# Altium schematic sheet LineDetector.SchDoc
size A; SheetNumber: 1; SheetTotal: 1
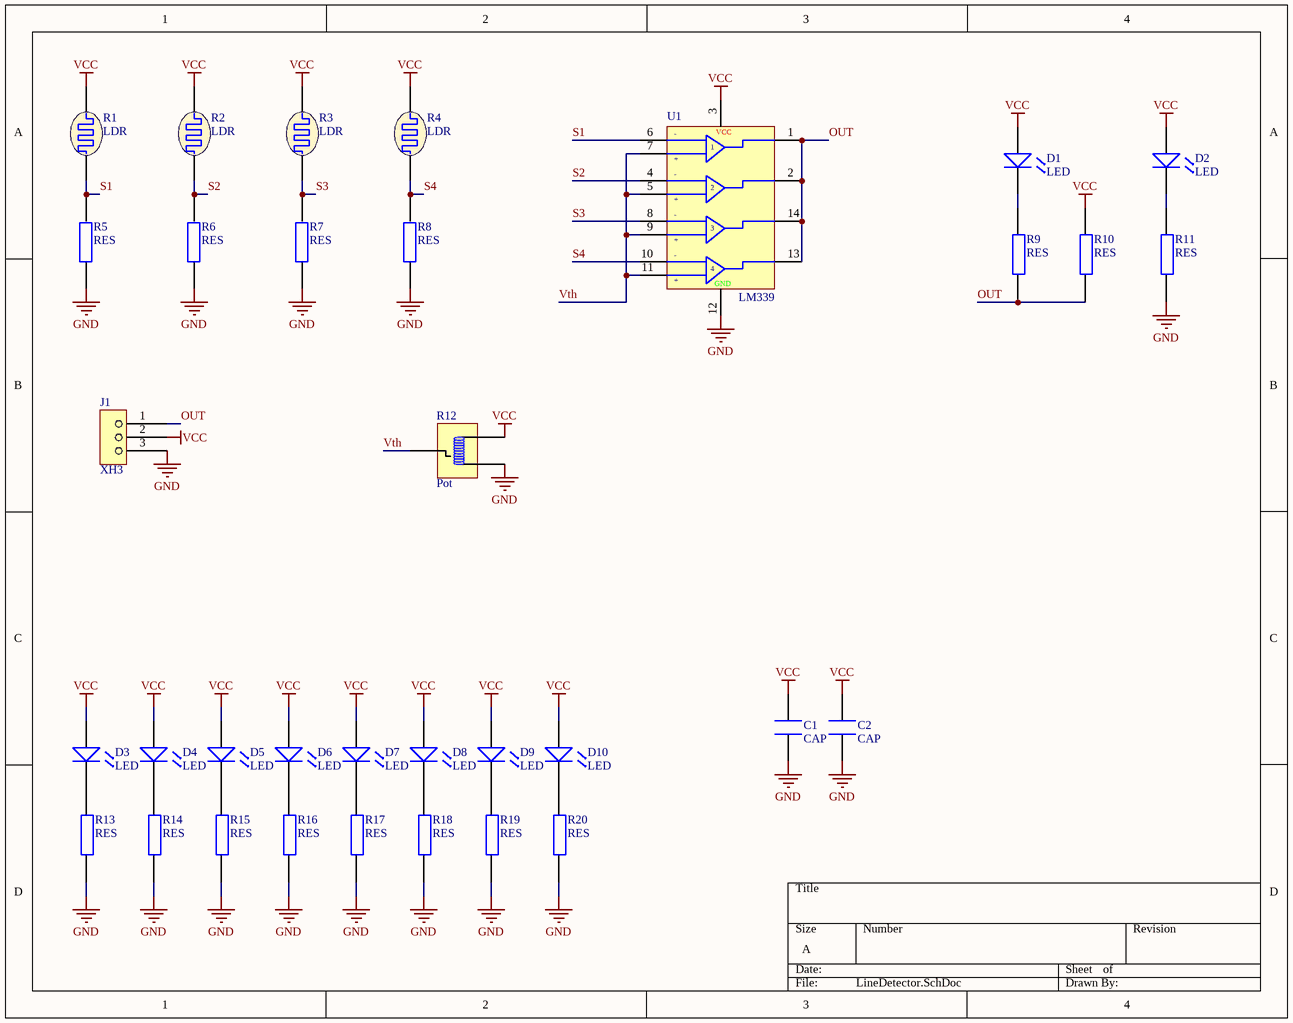
[diagram p0: LineDetector.SchDoc]

## Parts
C1  CAP  [CAP1206]
C2  CAP  [CAP1206]
D1  LED  [LED GREEN 1206]
D2  LED  [LED GREEN 1206]
D3  LED  [LED BLUE 1206]
D4  LED  [LED BLUE 1206]
D5  LED  [LED BLUE 1206]
D6  LED  [LED BLUE 1206]
D7  LED  [LED BLUE 1206]
D8  LED  [LED BLUE 1206]
D9  LED  [LED BLUE 1206]
D10  LED  [LED BLUE 1206]
J1  XH3  [XH 3PIN]
R1  LDR  [LDR]
R2  LDR  [LDR]
R3  LDR  [LDR]
R4  LDR  [LDR]
R5  RES  [RES1206]
R6  RES  [RES1206]
R7  RES  [RES1206]
R8  RES  [RES1206]
R9  RES  [RES1206]
R10  RES  [RES1206]
R11  RES  [RES1206]
R12  Pot  [potentiometer]
R13  RES  [RES1206]
R14  RES  [RES1206]
R15  RES  [RES1206]
R16  RES  [RES1206]
R17  RES  [RES1206]
R18  RES  [RES1206]
R19  RES  [RES1206]
R20  RES  [RES1206]
U1  LM339  [LM339]

## Nets
GND: C1.1 C2.1 J1.3 R5.1 R6.1 R7.1 R8.1 R11.2 R12.1 R13.2 R14.2 R15.2 R16.2 R17.2 R18.2 R19.2 R20.2 U1.12
VCC: C1.2 C2.2 D1.1 D2.1 D3.1 D4.1 D5.1 D6.1 D7.1 D8.1 D9.1 D10.1 J1.2 R1.1 R2.1 R3.1 R4.1 R10.1 R12.3 U1.3
OUT: J1.1 R9.2 R10.2 U1.1 U1.2 U1.13 U1.14
S1: R1.2 R5.2 U1.6
S2: R2.2 R6.2 U1.4
S3: R3.2 R7.2 U1.8
S4: R4.2 R8.2 U1.10
Vth: R12.2 U1.5 U1.7 U1.9 U1.11
NetD1_2: D1.2 R9.1
NetD2_2: D2.2 R11.1
NetD3_2: D3.2 R13.1
NetD4_2: D4.2 R14.1
NetD5_2: D5.2 R15.1
NetD6_2: D6.2 R16.1
NetD7_2: D7.2 R17.1
NetD8_2: D8.2 R18.1
NetD9_2: D9.2 R19.1
NetD10_2: D10.2 R20.1

## Notes on the sheet
- (in symbol LM339) -; VCC; +; GND

## Library data of the parts
C1 C2 = CAP1206: Capacitor SMD 1206
D1-D10 = LED SMD 1206
J1 = XH 3PIN: XH Connector 3pins
R1-R4 = LDR: Light Depended Resistor
R5-R11 R13-R20 = RES1206: RESISTOR SMD
R12 = Potentiometer: SMD Potentiometer
U1 = LM339: 4 Channel Comparetor - OpAmp